# EAGLE design ADXL335_Breakout (EAGLE 6.4)
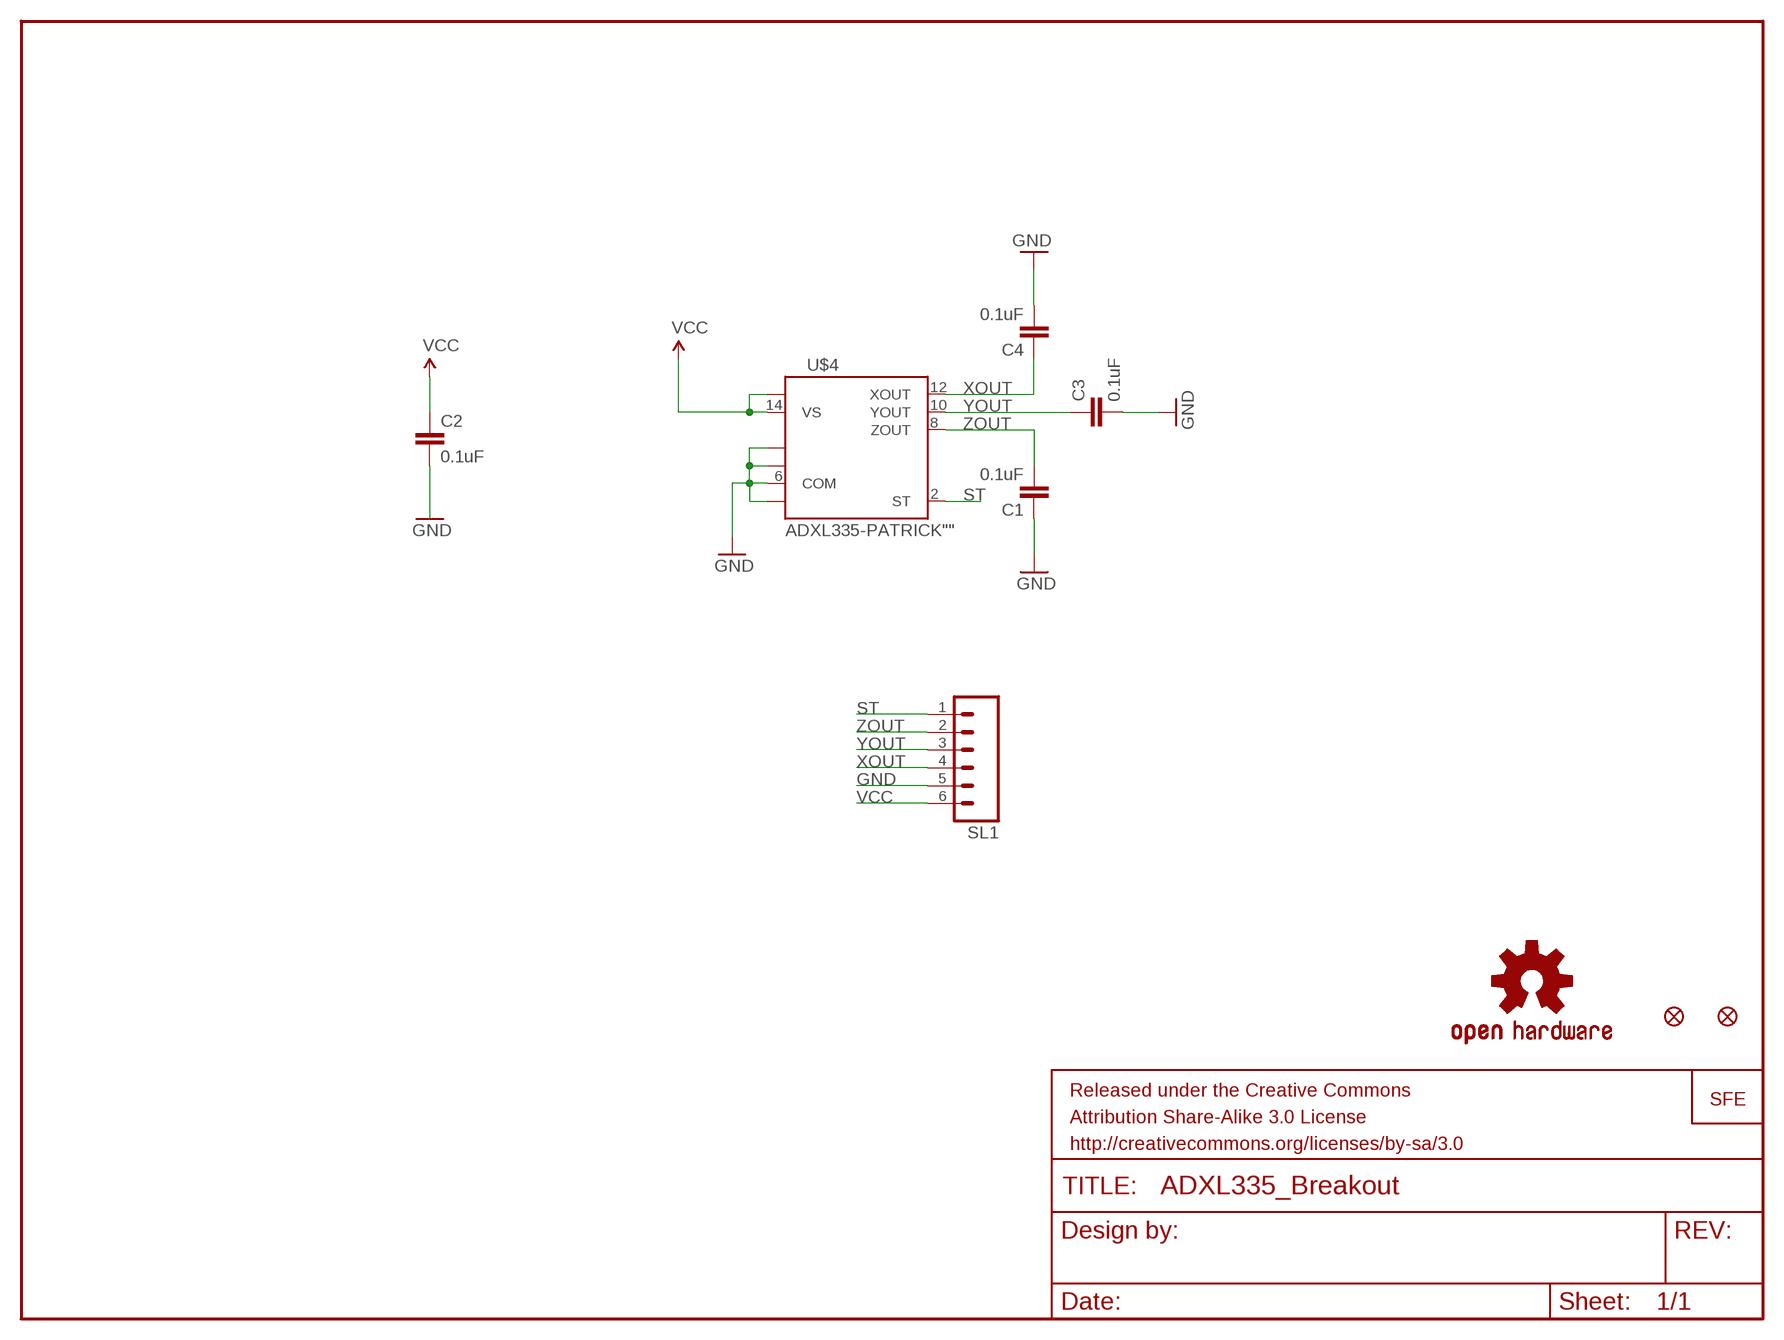
[diagram p0: schematic, sheet 1]

## Parts
C1  0.1uF  CAP0603-CAP  [0603-CAP]
C2  0.1uF  CAP0603-CAP  [0603-CAP]
C3  0.1uF  CAP0603-CAP  [0603-CAP]
C4  0.1uF  CAP0603-CAP  [0603-CAP]
SL1  M06SIP  [1X06]
U$1  FIDUCIAL1X2  [FIDUCIAL-1X2]
U$2  LOGO-SFE  LOGO-SFENEW  [SFE-NEW-WEBLOGO]
U$3  FIDUCIAL1X2  [FIDUCIAL-1X2]
U$4  ADXL335-PATRICK""  [ADXL335-P]
U$5  OSHW-LOGOS  [OSHW-LOGO-S]

## Nets
GND: C1.1 C2.2 C3.2 C4.2 SL1.5 U$4.3(COM) U$4.5(COM) U$4.6(COM) U$4.7(COM)
ST: SL1.1 U$4.2(ST)
VCC: C2.1 SL1.6 U$4.14(VS) U$4.15(VS)
XOUT: C4.1 SL1.4 U$4.12(XOUT)
YOUT: C3.1 SL1.3 U$4.10(YOUT)
ZOUT: C1.2 SL1.2 U$4.8(ZOUT)

## Library data of the parts
C1-C4 = SparkFun:CAP: Capacitor Standard 0603 ceramic capacitor, and 0.1" leaded capacitor.
SL1 = SparkFun:M06: Header 6 Standard 6-pin 0.1" header. Use with straight break away headers (SKU : PRT-00116), right angle break away headers (PRT-00553), swiss pins (PRT-00743), machine pins (PRT-00117), and female headers (PRT-00115). Molex polarized connector foot print use with SKU : PRT-08094 with associated crimp pins and housings. NOTES ON THE VARIANTS LOCK and LOCK_LONGPADS... This footprint was designed to help hold the alignment of a through-hole component (i.e. 6-pin header) while soldering it into place. You may notice that each hole has been shifted either up or down by 0.005 of an inch from it's more standard position (which is a perfectly straight line). This slight alteration caused the pins (the squares in the middle) to touch the edges of the holes. Because they are alternating, it causes a "brace" to hold the component in place. 0.005 has proven to be the perfect amount of "off-center" position when using our standard breakaway headers. Although looks a little odd when you look at the bare footprint, once you have a header in there, the alteration is very hard to notice. Also, if you push a header all the way into place, it is covered up entirely on the bottom side. This idea of altering the position of holes to aid alignment will be further integrated into the Sparkfun Library for other footprints. It can help hold any component with 3 or more connection pins.
U$1 U$3 = SparkFun:FIDUCIAL: Fiducial Alignment Points Various fiducial points for machine vision alignment.
U$2 = SparkFun:LOGO-SFE: Spark Fun Electronics PCB Logo This is the standard Spark Fun Electronics PCB logo.
U$4 = Testing:ADXL335-PATRICK
U$5 = SparkFun-Aesthetics:OSHW-LOGO: Open Source Hardware Logo This logo indicates the piece of hardware it is found on incorporates a OSHW license and/or adheres to the definition of open source hardware found here: http://freedomdefined.org/OSHW

## Board
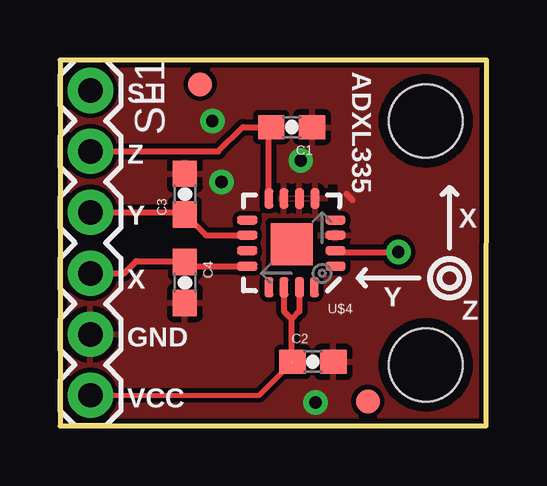
[diagram p1: board, top side]
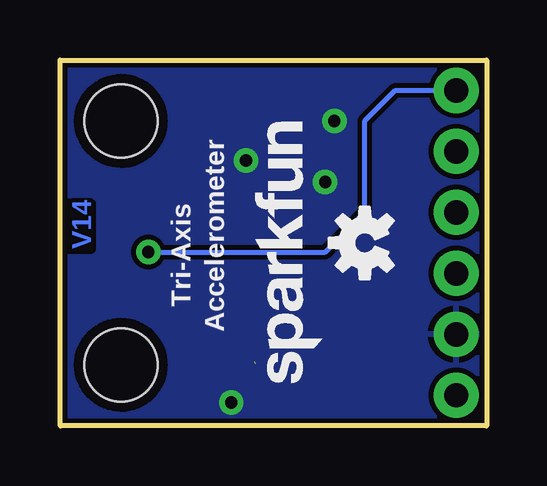
[diagram p2: board, bottom side, seen from below]

Size 17.78 x 15.24 mm. Coordinates in mm from the lower left corner, seen from the top.
Outline: 0,0 17.76,0 17.78,15.24 0,15.24 0,0
Copper layers (1*16): Top 0.035mm / dielectric 1.5mm / Bottom 0.035mm
Design rules "SparkFun": minimum track width 7mil, minimum drill 15mil, track to track 8mil, track to pad 8mil, pad to pad 8mil, via to via 8mil, smd to smd 8mil, copper to edge 8mil, drill to drill 8mil, minimum pad ring 12mil, minimum via ring 10mil, stop-mask expansion 4mil, vias tented up to drill 20mil, thermal gap 10mil
tRestrict: area 9.5,9.4 to 9.8,9.5; area 10.2,9.4 to 10.4,9.5; area 11.2,8.9 to 11.6,10

### Footprints (pad centres in the part's own frame; a part is rotated, then mirrored left to right if it is on the bottom)
0603-CAP = smd 1.1 x 1: 1 -0.85,0; 2 0.85,0
1X06 = drill 1.016 pad 1.88: 1 0,0; 2 2.54,0; 3 5.08,0; 4 7.62,0; 5 10.16,0; 6 12.7,0
FIDUCIAL-1X2 = smd 1 x 1: 1 0,0
ADXL335-P = smd 1.75 x 1.75: 0 0,0.051 | smd 0.838 x 0.37: 1 -1.826,0.975; 2 -1.826,0.325; 3 -1.826,-0.325; 4 -1.826,-0.95; 9 1.852,-0.95; 10 1.852,-0.325; 11 1.852,0.325; 12 1.852,0.975 | smd 0.37 x 0.838: 5 -0.975,-1.852; 6 -0.325,-1.852; 7 0.325,-1.852; 8 0.95,-1.852; 13 0.95,1.852; 14 0.325,1.852; 15 -0.325,1.852; 16 -0.95,1.852
STAND-OFF-TIGHT = hole 3.048: 0,0

### Placement (x,y rotation side)
C1  9.65,12.45 180 top
C2  10.54,2.67 0 top
C3  5.21,9.65 90 top
C4  5.21,5.97 270 top
SL1  1.27,13.97 270 top
U$1  5.84,14.22 0 top
U$3  12.83,1.02 0 top
U$4  9.65,7.62 180 top
U$5  [OSHW-LOGO-S]  5.08,7.62 90 bottom
U$6  [STAND-OFF-TIGHT]  15.24,2.54 0 top
U$7  [STAND-OFF-TIGHT]  15.24,12.7 0 top
U$8  [SFE_LOGO_NAME_.1]  6.35,1.27 90 bottom

### Tracks (layer width: path | path; a pad name or v marks a point on that pad's centre or on a via)
GND  (via drill 0.51)
  Top 0.254: 12.19,9.4 11.94,9.65 | C2.2 11.43,2.71
  other vias: 6.73,10.16 6.35,12.7 10.03,11.05 10.64,0.97
  pour Bottom: 0,15.24 17.78,15.24 17.78,0 0,0
  pour Top: 0,0 17.78,0 17.78,15.24 0,15.24
ST  (via drill 0.51)
  Top 0.254: U$4.2 11.53,7.24 v14.1,7.24
  Bottom 0.203: v14.1,7.24 6.73,7.24 5.08,8.89 5.08,12.7 3.81,13.97 SL1.1
VCC  (1 unrouted)
  Top 0.203: SL1.6 8.29,1.27 C2.1
  Top 0.254: U$4.14 9.33,4.77 9.65,4.45 | U$4.15 9.98,4.77 9.65,4.45 | 9.65,2.58 9.65,4.45
XOUT
  Top 0.254: U$4.12 5.38,6.64 C4.1 5.17,6.86 3.17,6.86 2.67,6.35 SL1.4
YOUT
  Top 0.254: U$4.10 6.06,7.95 C3.1 5.12,8.89 SL1.3
ZOUT
  Top 0.254: SL1.2 6.6,11.43 7.62,12.45 C1.2 8.7,12.35 U$4.8

### Text on the board
Bottom: V14
tPlace: ADXL335 | ST | Z | Y | X | X | Y | Z | GND | VCC
bPlace: Accelerometer | Tri-Axis